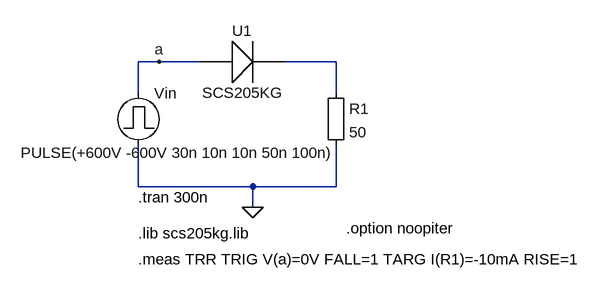
[diagram p0: schematic TRR-SiC-SCS205KG.asc]
TRR-SiC-SCS205KG.asc, the LTspice schematic file:
Version 4
SHEET 1 880 680
WIRE -176 80 -208 80
WIRE -112 80 -176 80
WIRE 96 80 16 80
WIRE -208 128 -208 80
WIRE 96 128 96 80
WIRE -208 272 -208 208
WIRE -32 272 -208 272
WIRE 96 272 96 208
WIRE 96 272 -32 272
WIRE -32 304 -32 272
FLAG -32 304 0
FLAG -176 80 a
SYMBOL Misc\\EuropeanResistor 80 112 R0
SYMATTR InstName R1
SYMATTR Value 50
SYMBOL pulse -208 112 R0
WINDOW 3 -181 108 Left 2
WINDOW 123 0 0 Left 0
WINDOW 39 0 0 Left 0
SYMATTR Value PULSE(+600V -600V 30n 10n 10n 50n 100n)
SYMATTR InstName Vin
SYMBOL Diode-ROHM-SCS205KG -48 80 R90
WINDOW 3 32 0 VTop 2
WINDOW 0 -32 0 VBottom 2
SYMATTR InstName U1
TEXT -208 288 Left 2 !.tran 300n
TEXT -208 344 Left 2 !.lib scs205kg.lib
TEXT -208 384 Left 2 !.meas TRR TRIG V(a)=0V FALL=1 TARG I(R1)=-10mA RISE=1
TEXT 112 336 Left 2 !.option noopiter

The netlist it stands for:
* TRR-SiC-SCS205KG.asc
R1 N001 0 50
Vin a 0 PULSE(+600V -600V 30n 10n 10n 50n 100n)
XU1 a N001 SCS205KG  ; pins A C
.tran 300n
.lib scs205kg.lib
.meas TRR TRIG V(a)=0V FALL=1 TARG I(R1)=-10mA RISE=1
.option noopiter
.backanno
.end